# Altium schematic sheet Ext_connections.SchDoc: External Connections
size A; Author: James Thomas; CompanyName: BYUI; DrawnBy: James Thomas; Engineer: James Thomas; Organization: CSEE; DocumentNumber: 10; Revision: 0.0.1; SheetNumber: 10; SheetTotal: 15
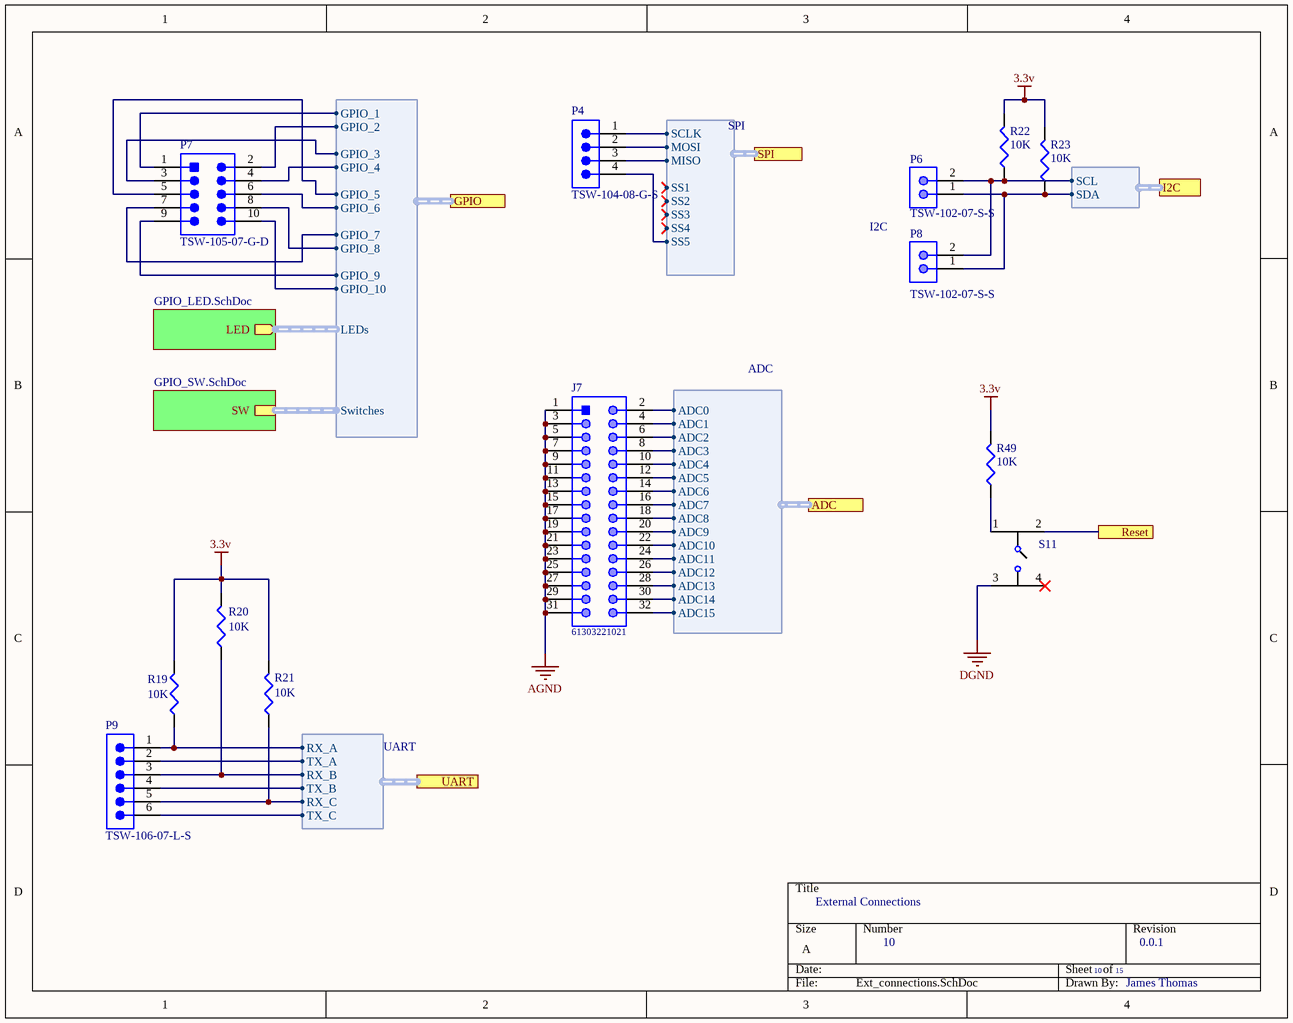
[diagram p0: Ext_connections.SchDoc]

## Parts
J7  61303221021  [61303221021]
P4  TSW-104-08-G-S  [SMTC-TSW-104-08-X-S]
P6  TSW-102-07-S-S  [SMTC-TSW-102-07-S-S]
P7  TSW-105-07-G-D  [SMTC-TSW-105-07-G-D_V]
P8  TSW-102-07-S-S  [SMTC-TSW-102-07-S-S]
P9  TSW-106-07-L-S  [SMTC-TSW-106-07-X-S]
R19  value 10K  [J1-0603]  (hidden comment: Res3)
R20  value 10K  [J1-0603]  (hidden comment: Res3)
R21  value 10K  [J1-0603]  (hidden comment: Res3)
R22  value 10K  [J1-0603]  (hidden comment: Res3)
R23  value 10K  [J1-0603]  (hidden comment: Res3)
R49  value 10K  [J1-0603]  (hidden comment: Res3)
S11  430181038816  [*430181038816]  (value not drawn)

## Sub-sheets
Designator = GPIO_SW.SchDoc: SW (harness SW)
Designator = GPIO_LED.SchDoc: LED (out, harness LED)

## Ports
ADC (harness ADC), GPIO (harness GPIO), I2C (harness I2C), Reset, SPI (harness SPI), UART (harness UART)

## Harnesses
I2C: SCL, SDA
SPI: SCLK, MOSI, MISO, SS5, SS2, SS3, SS1, SS4
UART: RX_A, TX_A, RX_B, TX_B, RX_C, TX_C
GPIO: GPIO_1, GPIO_2, GPIO_3, GPIO_4, GPIO_5, GPIO_6, GPIO_7, GPIO_8, GPIO_9, GPIO_10, LEDs, Switches
ADC: ADC0, ADC1, ADC2, ADC3, ADC4, ADC5, ADC6, ADC7, ADC8, ADC9, ADC10, ADC11, ADC12, ADC13, ADC14, ADC15

## Nets
3.3v: R19.2 R20.2 R21.2 R22.2 R23.2 R49.2
AGND: J7.1 J7.3 J7.5 J7.7 J7.9 J7.11 J7.13 J7.15 J7.17 J7.19 J7.21 J7.23 J7.25 J7.27 J7.29 J7.31
DGND: S11.3
Reset: S11.2 ; port Reset
NetJ7_2: J7.2 ; port ADC.ADC0
NetJ7_4: J7.4 ; port ADC.ADC1
NetJ7_6: J7.6 ; port ADC.ADC2
NetJ7_8: J7.8 ; port ADC.ADC3
NetJ7_10: J7.10 ; port ADC.ADC4
NetJ7_12: J7.12 ; port ADC.ADC5
NetJ7_14: J7.14 ; port ADC.ADC6
NetJ7_16: J7.16 ; port ADC.ADC7
NetJ7_18: J7.18 ; port ADC.ADC8
NetJ7_20: J7.20 ; port ADC.ADC9
NetJ7_22: J7.22 ; port ADC.ADC10
NetJ7_24: J7.24 ; port ADC.ADC11
NetJ7_26: J7.26 ; port ADC.ADC12
NetJ7_28: J7.28 ; port ADC.ADC13
NetJ7_30: J7.30 ; port ADC.ADC14
NetJ7_32: J7.32 ; port ADC.ADC15
NetP4_1: P4.1 ; port SPI.SCLK
NetP4_2: P4.2 ; port SPI.MOSI
NetP4_3: P4.3 ; port SPI.MISO
NetP4_4: P4.4 ; port SPI.SS5
NetP6_1: P6.1 P8.1 R23.1 ; port I2C.SDA
NetP6_2: P6.2 P8.2 R22.1 ; port I2C.SCL
NetP7_1: P7.1 ; port GPIO.GPIO_1
NetP7_2: P7.2 ; port GPIO.GPIO_2
NetP7_3: P7.3 ; port GPIO.GPIO_3
NetP7_4: P7.4 ; port GPIO.GPIO_4
NetP7_5: P7.5 ; port GPIO.GPIO_5
NetP7_6: P7.6 ; port GPIO.GPIO_6
NetP7_7: P7.7 ; port GPIO.GPIO_7
NetP7_8: P7.8 ; port GPIO.GPIO_8
NetP7_9: P7.9 ; port GPIO.GPIO_9
NetP7_10: P7.10 ; port GPIO.GPIO_10
NetP9_1: P9.1 R19.1 ; port UART.RX_A
NetP9_2: P9.2 ; port UART.TX_A
NetP9_3: P9.3 R20.1 ; port UART.RX_B
NetP9_4: P9.4 ; port UART.TX_B
NetP9_5: P9.5 R21.1 ; port UART.RX_C
NetP9_6: P9.6 ; port UART.TX_C
NetR49_1: R49.1 S11.1

Not connected (* = marked no-connect by the designer): S11 4*

## Notes on the sheet
- I2C

## Library data of the parts
J7 = CMP-1502-01123-1: THT Angled Pin Header WR-PHD, Pitch 2.54 mm, Dual Row, 32 pins; Manufacturer: Wurth Elektronik; Pitch: 2.54mm; Gender: Male; Rated Current: 3A; Withstanding Voltage: 500VAC; Working Voltage: 250VAC; Contact Resistance: 20mOhm; Pin Number: 32; Datasheet URL: https://katalog.we-online.de/em/datasheet/6130xx21021.pdf; Row Number: Dual; Orientation: Angled; Publisher: WurthElektronik; Mounting Technology: THT; Package Reference: 61303221021; Operating Temperature: -40to105degC; Manufacturer URL: http://www.we-online.de; Packaging: Bag; Part Number: 61303221021
P4 = CMP-1024-00357-1: 0.025" SQ Post Header, Through-hole, Vertical, -55 to 125 degC, 2.54 mm Pitch, 4-Pin, Male, RoHS; Manufacturer: Samtec; Pitch: 2.54 mm; RoHS: True; ComponentLink3URL: http://www.samtec.com/documents/webfiles/cpdf/TSW-XXX-XX-XXX-X-XX-XXX-MKT.pdf; Mounting Technology: Through-hole; ComponentLink2URL: http://www.samtec.com/documents/webfiles/pdf/TSW_TH.PDF; ComponentLink1URL: http://www.samtec.com; ComponentLink3Description: Package Specification; PackageVersion: DM, 8/1988; ComponentLink2Description: Datasheet; PackageReference: TSW-104-08-X-S; PackageDescription: .025[0.64] SQ. Post Terminal Strip Assembly; PartNumber: TSW-104-08-G-S; ComponentLink1Description: Manufacturer URL; Temperature Range: -55 to 125 degC; DatasheetVersion: F-214; Orientation: Vertical
P6 P8 = CMP-1681-00004-4: Male Header, Pitch 2.54 mm, 1 x 2 Position, Height 8.38 mm, Tail Length 2.54 mm, -55 to 125 degC, RoHS, Bulk; Manufacturer: Samtec; Rows: 1; ComponentLink1URL: http://www.samtec.com/; Contact Finish: Gold; Mounting Technology: Through Hole; PackageReference: TSW-102-07-S-S; RoHSCompliant: true; Pins: 2; Contact Material: Bronze; ComponentLink2Description: Datasheet; Max Operating Temperature: 125 degC; Min Operating Temperature: -55 degC; Height: 8.38 mm; Packaging: Bulk; ComponentLink1Description: Manufacturer URL; PackageDescription: Male Header, Pitch 2.54 mm, 1 x 2 Position, Height 8.38 mm, Tail Length 2.54 mm; Colour: Black; Contact Plating: Gold; Length: 5.08 mm; ComponentLink2URL: http://suddendocs.samtec.com/catalog_english/tsw_th.pdf; DatasheetVersion: 12/2015; Mount: Through Hole; Lead Pitch: 0.1 inch; REACH SVHC: No SVHC; Package Quantity: 1
P7 = CMP-2000-07330-1: Post Terminal Strip Assembly, Pitch 2.54 mm, 2 x 5 Position, Height 8.58 mm, Tail Length 2.54 mm, -55 to 125 degC, RoHS, Bulk; Manufacturer: Samtec-Inc.; Connector Type: Header,Unshrouded; Number of Positions Loaded: All; Pitch: 0.100"(2.54mm); Number of Positions: 10; Package Reference: TSW-105-07-G-D; Mounting Technology: ThroughHole; Datasheet URL: http://suddendocs.samtec.com/prints/tsw-xxx-xx-xxx-x-xx-xxx-mkt.pdf; Termination: Solder; Packaging: Bulk; Number of Rows: 2; Contact Finish: Gold; Mounting Type: ThroughHole; Features: -; Color: Black; Category: Connectors,Interconnects; Family: RectangularConnectors-Headers,MalePins; Manufacturer URL: http://www.samtec.com/; Series: TSW; Fastening Type: -; Package URL: http://suddendocs.samtec.com/prints/tsw-xxx-xx-x-x-xx-xxx-footprint.pdf; Row Spacing: 0.100"(2.54mm); Contact Mating Length: 0.230"(5.84mm); Contact Finish Thickness: 10µin(0.25µm); Contact Type: MalePin; Package Description: Male Header, Pitch 2.54 mm, 2 x 5 Position, Height 8.58 mm, Tail Length 2.54 mm; Datasheet Version: Rev. DO, 08/1988
P9 = CMP-1024-00386-1: 0.025" SQ Post Header, Through-hole, Vertical, -55 to 125 degC, 2.54 mm Pitch, 6-Pin, Male, RoHS; Manufacturer: Samtec; Pitch: 2.54 mm; RoHS: True; PartNumber: TSW-106-07-L-S; Orientation: Vertical; PackageReference: TSW-106-07-X-S; PackageDescription: .025[0.64] SQ. Post Terminal Strip Assembly; DatasheetVersion: F-214; ComponentLink3Description: Package Specification; Mounting Technology: Through-hole; ComponentLink2Description: Datasheet; PackageVersion: DM, 8/1988; ComponentLink3URL: http://www.samtec.com/documents/webfiles/cpdf/TSW-XXX-XX-XXX-X-XX-XXX-MKT.pdf; Temperature Range: -55 to 125 degC; ComponentLink2URL: http://www.samtec.com/documents/webfiles/pdf/TSW_TH.PDF; ComponentLink1Description: Manufacturer URL; ComponentLink1URL: http://www.samtec.com
R19-R23 R49 = Res3: Resistor; Published: 8-Jun-2000; LatestRevisionDate: 29-May-2009; LatestRevisionNote: IPC-7351 Footprint Added.; PackageReference: J1-0603; Publisher: Altium Limited; PackageDescription: Chip Resistor
S11 = 430181038816: Tactile Switch SPST-NO Top Actuated Surface Mount; MF: Wurth Electronics; Package: None; MP: 430181038816; Price: None; Availability: Unavailable; SnapEDA_Link: https://www.snapeda.com/parts/430181038816/Wurth%20Electronics%20Inc./view-part/523500/?ref=snap; Value: *